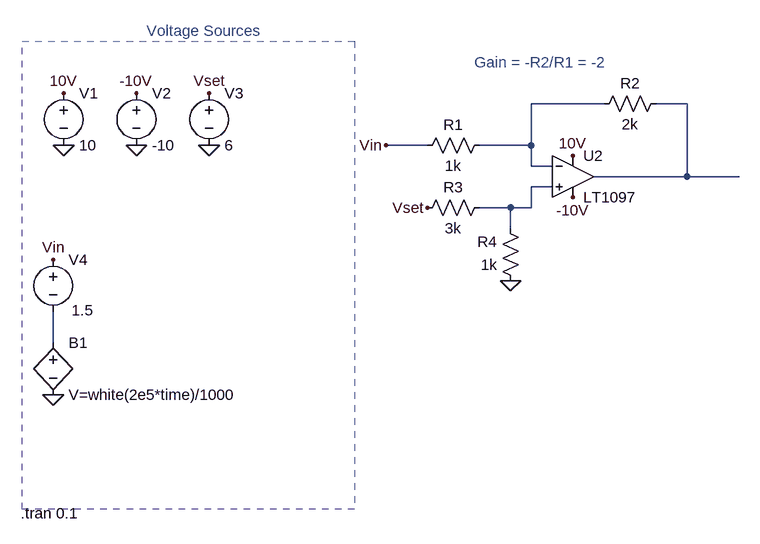
[diagram p0: schematic opamp1.asc]
opamp1.asc, the LTspice schematic file:
Version 4
SHEET 1 880 728
WIRE 192 80 80 80
WIRE 320 80 272 80
WIRE -80 144 -144 144
WIRE 80 144 80 80
WIRE 80 144 0 144
WIRE 80 176 80 144
WIRE 112 176 80 176
WIRE 320 192 320 80
WIRE 320 192 176 192
WIRE 400 192 320 192
WIRE 112 208 80 208
WIRE 48 240 0 240
WIRE 80 240 80 208
WIRE 80 240 48 240
WIRE 48 272 48 240
WIRE -656 448 -656 400
FLAG -640 64 10V
FLAG -528 64 -10V
FLAG -640 144 0
FLAG -528 144 0
FLAG 144 160 10V
FLAG 144 224 -10V
FLAG -416 64 Vset
FLAG -416 144 0
FLAG -656 320 Vin
FLAG 48 352 0
FLAG -80 240 Vset
FLAG -144 144 Vin
FLAG -656 528 0
SYMBOL Opamps\\LT1097 144 128 R0
SYMATTR InstName U2
SYMBOL res 16 128 R90
WINDOW 0 0 56 VBottom 2
WINDOW 3 32 56 VTop 2
SYMATTR InstName R1
SYMATTR Value 1k
SYMBOL res 288 64 R90
WINDOW 0 0 56 VBottom 2
WINDOW 3 32 56 VTop 2
SYMATTR InstName R2
SYMATTR Value 2k
SYMBOL res 16 224 R90
WINDOW 0 0 56 VBottom 2
WINDOW 3 32 56 VTop 2
SYMATTR InstName R3
SYMATTR Value 3k
SYMBOL res 64 368 R180
WINDOW 0 36 76 Left 2
WINDOW 3 36 40 Left 2
SYMATTR InstName R4
SYMATTR Value 1k
SYMBOL voltage -640 48 R0
WINDOW 123 0 0 Left 0
WINDOW 39 0 0 Left 0
SYMATTR InstName V1
SYMATTR Value 10
SYMBOL voltage -528 48 R0
SYMATTR InstName V2
SYMATTR Value -10
SYMBOL voltage -416 48 R0
WINDOW 123 0 0 Left 0
WINDOW 39 0 0 Left 0
SYMATTR InstName V3
SYMATTR Value 6
SYMBOL voltage -656 304 R0
WINDOW 3 28 94 Left 2
WINDOW 123 0 0 Left 0
WINDOW 39 0 0 Left 0
SYMATTR InstName V4
SYMATTR Value 1.5
SYMBOL bv -656 432 R0
SYMATTR InstName B1
SYMATTR Value V=white(2e5*time)/1000
TEXT -512 -32 Left 2 ;Voltage Sources
TEXT -8 16 Left 2 ;Gain = -R2/R1 = -2
TEXT -706 710 Left 2 !.tran 0.1
RECTANGLE Normal -192 704 -704 -16 2

The netlist it stands for:
* opamp1.asc
XU2 N003 N001 10V -10V N002 LT1097  ; pins In+ In- V+ V- OUT
R1 N001 Vin 1k
R2 N002 N001 2k
R3 N003 Vset 3k
R4 0 N003 1k
V1 10V 0 10
V2 -10V 0 -10
V3 Vset 0 6
V4 Vin N004 1.5
B1 N004 0 V=white(2e5*time)/1000
* Voltage Sources
* Gain = -R2/R1 = -2
.tran 0.1
.backanno
.end